# Altium schematic sheet OLD_Trigger_And_Clock_Muxing.SchDoc
size A3; ApprovedBy: Mateusz Kowalik; CheckedBy: Mateusz Kowalik; Author: Mateusz Kowalik; CompanyName: InMotion Labs sp. z o.o.; DrawnBy: Mateusz Kowalik; Engineer: Mateusz Kowalik; Organization: InMotion Labs sp. z o.o.; Address1: Rydlówka 5A; Address2: 30-363 Kraków; Address4: Poland; Revision: Rev 0; SheetNumber: 4; SheetTotal: 16
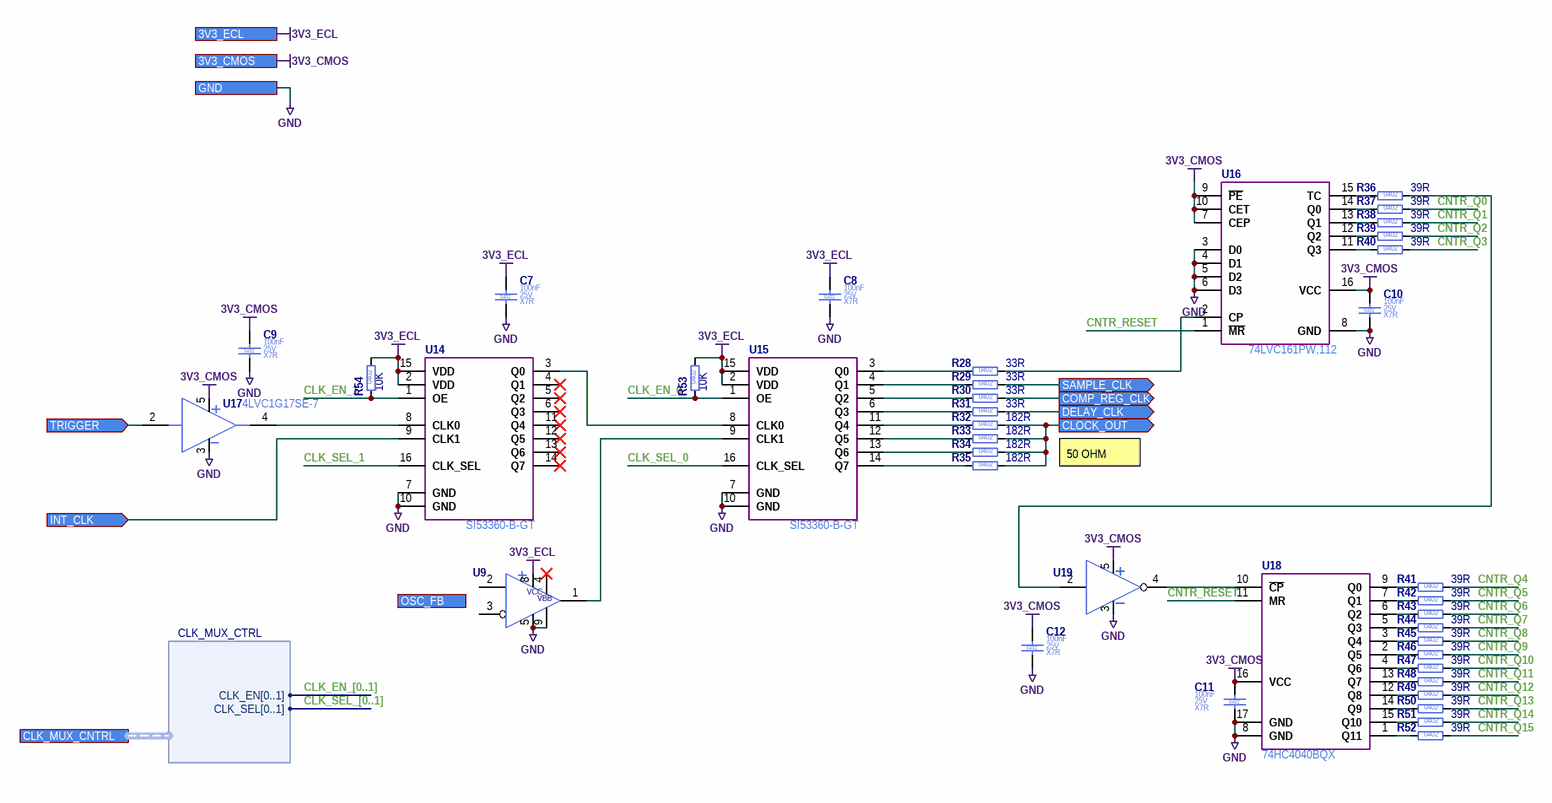
[diagram p0: OLD_Trigger_And_Clock_Muxing.SchDoc]

## Parts
C7  Case/Package: 0402  Voltage Rating (DC): 25V  Dielectric: X7R  Capacitance: 100nF  [C_0402_1005]  (hidden comment: C_100NF_25V_X7R_0402_10)
C8  Case/Package: 0402  Voltage Rating (DC): 25V  Dielectric: X7R  Capacitance: 100nF  [C_0402_1005]  (hidden comment: C_100NF_25V_X7R_0402_10)
C9  Case/Package: 0402  Voltage Rating (DC): 25V  Dielectric: X7R  Capacitance: 100nF  [C_0402_1005]  (hidden comment: C_100NF_25V_X7R_0402_10)
C10  Case/Package: 0402  Voltage Rating (DC): 25V  Dielectric: X7R  Capacitance: 100nF  [C_0402_1005]  (hidden comment: C_100NF_25V_X7R_0402_10)
C11  Case/Package: 0402  Voltage Rating (DC): 25V  Dielectric: X7R  Capacitance: 100nF  [C_0402_1005]  (hidden comment: C_100NF_25V_X7R_0402_10)
C12  Case/Package: 0402  Voltage Rating (DC): 25V  Dielectric: X7R  Capacitance: 100nF  [C_0402_1005]  (hidden comment: C_100NF_25V_X7R_0402_10)
R28  Resistance: 33R  Case/Package: 0402  [R_0402_1005]  (hidden comment: R_33R_0402_1)
R29  Resistance: 33R  Case/Package: 0402  [R_0402_1005]  (hidden comment: R_33R_0402_1)
R30  Resistance: 33R  Case/Package: 0402  [R_0402_1005]  (hidden comment: R_33R_0402_1)
R31  Resistance: 33R  Case/Package: 0402  [R_0402_1005]  (hidden comment: R_33R_0402_1)
R32  Resistance: 182R  Case/Package: 0402  [R_0402_1005]  (hidden comment: R_182R_0402_1)
R33  Resistance: 182R  Case/Package: 0402  [R_0402_1005]  (hidden comment: R_182R_0402_1)
R34  Resistance: 182R  Case/Package: 0402  [R_0402_1005]  (hidden comment: R_182R_0402_1)
R35  Resistance: 182R  Case/Package: 0402  [R_0402_1005]  (hidden comment: R_182R_0402_1)
R36  Resistance: 39R  Case/Package: 0402  [R_0402_1005]  (hidden comment: R_39R_0402_1)
R37  Resistance: 39R  Case/Package: 0402  [R_0402_1005]  (hidden comment: R_39R_0402_1)
R38  Resistance: 39R  Case/Package: 0402  [R_0402_1005]  (hidden comment: R_39R_0402_1)
R39  Resistance: 39R  Case/Package: 0402  [R_0402_1005]  (hidden comment: R_39R_0402_1)
R40  Resistance: 39R  Case/Package: 0402  [R_0402_1005]  (hidden comment: R_39R_0402_1)
R41  Resistance: 39R  Case/Package: 0402  [R_0402_1005]  (hidden comment: R_39R_0402_1)
R42  Resistance: 39R  Case/Package: 0402  [R_0402_1005]  (hidden comment: R_39R_0402_1)
R43  Resistance: 39R  Case/Package: 0402  [R_0402_1005]  (hidden comment: R_39R_0402_1)
R44  Resistance: 39R  Case/Package: 0402  [R_0402_1005]  (hidden comment: R_39R_0402_1)
R45  Resistance: 39R  Case/Package: 0402  [R_0402_1005]  (hidden comment: R_39R_0402_1)
R46  Resistance: 39R  Case/Package: 0402  [R_0402_1005]  (hidden comment: R_39R_0402_1)
R47  Resistance: 39R  Case/Package: 0402  [R_0402_1005]  (hidden comment: R_39R_0402_1)
R48  Resistance: 39R  Case/Package: 0402  [R_0402_1005]  (hidden comment: R_39R_0402_1)
R49  Resistance: 39R  Case/Package: 0402  [R_0402_1005]  (hidden comment: R_39R_0402_1)
R50  Resistance: 39R  Case/Package: 0402  [R_0402_1005]  (hidden comment: R_39R_0402_1)
R51  Resistance: 39R  Case/Package: 0402  [R_0402_1005]  (hidden comment: R_39R_0402_1)
R52  Resistance: 39R  Case/Package: 0402  [R_0402_1005]  (hidden comment: R_39R_0402_1)
R53  Resistance: 10K  Case/Package: 0402  [R_0402_1005]  (hidden comment: R_10K_0402_1)
R54  Resistance: 10K  Case/Package: 0402  [R_0402_1005]  (hidden comment: R_10K_0402_1)
U9  MC100EPT21MNR4G  [SON50P200X80_HS-9N]  (value not drawn)
U14  Si53360-B-GT  [TSOP65P640X120-16N]
U15  Si53360-B-GT  [TSOP65P640X120-16N]
U16  74LVC161PW,112  [TSOP65P640X120-16N]
U17  74LVC1G17SE-7  [SC70-5_SOT353_TSSOP5]
U18  74HC4040BQX  [QFN50P350X250X100_HS-17N]
U19  SN74AHC1G04DBVR  [SOT23-5_SC74A_SOT753_M]  (value not drawn)

## Ports
3V3_CMOS, 3V3_ECL, CLK_MUX_CNTRL (harness CLK_MUX_CTRL), CLOCK_OUT (out), COMP_REG_CLK (out), DELAY_CLK (out), GND, INT_CLK (in), OSC_FB (out), SAMPLE_CLK (out), TRIGGER (in)

## Harnesses
CLK_MUX_CTRL: CLK_SEL[0..1], CLK_EN[0..1]

## Nets
3V3_CMOS: C9.1 C10.1 C11.1 C12.1 U16.7(CEP) U16.9(~{PE}) U16.10(CET) U16.16(VCC) U17.5(VCC) U18.16(VCC) U19.5(VCC) ; port 3V3_CMOS
3V3_ECL: C7.1 C8.1 R53.2 R54.2 U9.8(VDD) U14.2(VDD) U14.15(VDD) U15.2(VDD) U15.15(VDD) ; port 3V3_ECL
GND: C7.2 C8.2 C9.2 C10.2 C11.2 C12.2 U9.5(VSS) U9.9(VSS) U14.7(GND) U14.10(GND) U15.7(GND) U15.10(GND) U16.3(D0) U16.4(D1) U16.5(D2) U16.6(D3) U16.8(GND) U17.3(GND) U18.8(GND) U18.17(GND) U19.3(GND) ; port GND
CLK_EN_0: R53.1 U15.1(OE)
CLK_EN_1: R54.1 U14.1(OE)
CLK_SEL_0: U15.16(CLK_SEL)
CLK_SEL_1: U14.16(CLK_SEL)
CLOCK_OUT: R32.2 R33.2 R34.2 R35.2 ; port CLOCK_OUT
CNTR_Q0: R37.2
CNTR_Q1: R38.2
CNTR_Q2: R39.2
CNTR_Q3: R40.2
CNTR_Q4: R41.2
CNTR_Q5: R42.2
CNTR_Q6: R43.2
CNTR_Q7: R44.2
CNTR_Q8: R45.2
CNTR_Q9: R46.2
CNTR_Q10: R47.2
CNTR_Q11: R48.2
CNTR_Q12: R49.2
CNTR_Q13: R50.2
CNTR_Q14: R51.2
CNTR_Q15: R52.2
CNTR_RESET: U16.1(~{MR}) U18.11(MR)
COMP_REG_CLK: R30.2 ; port COMP_REG_CLK
DELAY_CLK: R31.2 ; port DELAY_CLK
INT_CLK: U14.9(CLK1) ; port INT_CLK
SAMPLE_CLK: R29.2 ; port SAMPLE_CLK
TRIGGER: U17.2(A) ; port TRIGGER
NetR28_1: R28.1 U15.3(Q0)
NetR28_2: R28.2 U16.2(CP)
NetR29_1: R29.1 U15.4(Q1)
NetR30_1: R30.1 U15.5(Q2)
NetR31_1: R31.1 U15.6(Q3)
NetR32_1: R32.1 U15.11(Q4)
NetR33_1: R33.1 U15.12(Q5)
NetR34_1: R34.1 U15.13(Q6)
NetR35_1: R35.1 U15.14(Q7)
NetR36_1: R36.1 U16.15(TC)
NetR36_2: R36.2 U19.2
NetR37_1: R37.1 U16.14(Q0)
NetR38_1: R38.1 U16.13(Q1)
NetR39_1: R39.1 U16.12(Q2)
NetR40_1: R40.1 U16.11(Q3)
NetR41_1: R41.1 U18.9(Q0)
NetR42_1: R42.1 U18.7(Q1)
NetR43_1: R43.1 U18.6(Q2)
NetR44_1: R44.1 U18.5(Q3)
NetR45_1: R45.1 U18.3(Q4)
NetR46_1: R46.1 U18.2(Q5)
NetR47_1: R47.1 U18.4(Q6)
NetR48_1: R48.1 U18.13(Q7)
NetR49_1: R49.1 U18.12(Q8)
NetR50_1: R50.1 U18.14(Q9)
NetR51_1: R51.1 U18.15(Q10)
NetR52_1: R52.1 U18.1(Q11)
NetU9_1: U9.1(OUTA) U15.9(CLK1)
NetU14_3: U14.3(Q0) U15.8(CLK0)
NetU14_8: U14.8(CLK0) U17.4(Y)
NetU18_10: U18.10(~{CP}) U19.4(OutY)

Not connected (* = marked no-connect by the designer): U9 2(D) 3(~{D}) 4(VDD)*; U14 4(Q1)* 5(Q2)* 6(Q3)* 11(Q4)* 12(Q5)* 13(Q6)* 14(Q7)*; U19 1(NC)

## Buses and harness runs
bus CLK_EN_[0..1]
bus CLK_SEL_[0..1]

## Notes on the sheet
- 50 OHM
- Title
- Size:
- Date:
- A3
- (in symbol MC100EPT21MNR4G) VCC; VBB

## Library data of the parts
C7-C12 = C_100NF_25V_X7R_0402_10: Ceramic Capacitor; Manufacturer Part Number: EMK105B7104KV-F; Manufacturer: Taiyo Yuden; Value: 100nF; Tolerance: 10%; Part Number: C_100NF_25V_X7R_0402_10; Mount: Surface Mount; Height: 500um; HelpURL: https://pl.mouser.com/datasheet/2/396/mlcc02_e-1307760.pdf; RoHS: Compliant; Max Operating Temperature: 125°C; Status: AK; Supplier 1: Mouser; Supplier Part Number 1: 963-EMK105B7104KV-F
R28-R31 = R_33R_0402_1: Thick Film Resistor; Manufacturer: Yageo; Manufacturer Part Number: RC0402FR-0733RL; Value: 33R; Tolerance: 1%; Voltage Rating (DC): 50V; Power Rating: 63mW; Stats: MK; Part Number: R_33R_0402_1; Mount: Surface Mount; Height: 350um; HelpURL: https://pl.mouser.com/datasheet/2/447/PYu-RC_Group_51_RoHS_L_10-1527934.pdf; RoHS: Compliant; Max Operating Temperature: 155°C; Supplier 1: Mouser; Supplier Part Number 1: 603-RC0402FR-0733RL
R32-R35 = R_182R_0402_1: Thick Film Resistor; Manufacturer: Yageo; Manufacturer Part Number: RC0402FR-07182RL; Value: 182R; Tolerance: 1%; Voltage Rating (DC): 50V; Power Rating: 63mW; Stats: MK; Part Number: R_182R_0402_1; Mount: Surface Mount; Height: 350um; HelpURL: http://datasheet.octopart.com/RC0402FR-07100KL-Yageo-datasheet-127823281.pdf; RoHS: Compliant; Max Operating Temperature: 155°C; Supplier 1: Mouser; Supplier Part Number 1: 603-RC0402FR-07182RL
R36-R52 = R_39R_0402_1: Thick Film Resistor; Manufacturer: Yageo; Manufacturer Part Number: RC0402FR-0739RL; Value: 39R; Tolerance: 1%; Voltage Rating (DC): 50V; Power Rating: 63mW; Stats: MK; Part Number: R_39R_0402_1; Mount: Surface Mount; Height: 350um; HelpURL: https://pl.mouser.com/datasheet/2/447/PYu-RC_Group_51_RoHS_L_10-1664068.pdf; RoHS: Compliant; Max Operating Temperature: 155°C; Supplier 1: Mouser; Supplier Part Number 1: 603-RC0402FR-0739RL
R53 R54 = R_10K_0402_1: Thick Film Resistor; Manufacturer: Yageo; Manufacturer Part Number: RC0402FR-7W10KL; Value: 10K; Tolerance: 1%; Voltage Rating (DC): 50V; Power Rating: 63mW; Stats: MK; Part Number: R_10K_0402_1; Mount: Surface Mount; Height: 350um; HelpURL: https://pl.mouser.com/datasheet/2/447/PYu-RC_Group_51_RoHS_L_10-1664068.pdf; RoHS: Compliant; Max Operating Temperature: 155°C; Supplier 1: Mouser; Supplier Part Number 1: 603-RC0402FR-7W10KL
U9 = MC100EPT21MNR4G: Differential LVPECL/LVDS/CML to LVTTL/LVCMOS Translator; Manufacturer: ON Semiconductor; Output Current: 24mA; Marking: 3RM; Max Supply Voltage: 3.8V; Min Supply Voltage: 3.3V; Part Number: MC100EPT21MNR4G; Case/Package: DFN-8; Max Output Current: 24mA; Mount: Surface Mount; Height: 1mm; HelpURL: https://datasheet.octopart.com/MC100EPT21MNR4G-ON-Semiconductor-datasheet-12520234.pdf; Max Operating Temperature: 85°C; RoHS: Compliant; Status: MK; Manufacturer Part Number: MC100EPT21MNR4G; Supplier 1: Mouser; Supplier Part Number 1: 863-MC100EPT21MNR4G
U14 U15 = Si53360-B-GT: Low Jitter Clock Buffer; Manufacturer: Silicon Labs; Max Frequency: 200MHz; Max Supply Voltage: 3.6V; Min Supply Voltage: 2.25V; Part Number: Si53360-B-GT; Case/Package: TSSOP16; Mount: Surface Mount; Height: 1.2mm; HelpURL: https://pl.mouser.com/datasheet/2/368/Si5336x-datasheet-1397964.pdf; Logic Function: Clock Buffer; Marking: Si53360; Max Operating Temperature: 85°C; RoHS: Compliant; Status: MK; Manufacturer Part Number: SI53360-B-GT; Supplier 1: Mouser; Supplier Part Number 1: 634-SI53360-B-GT
U16 = 74LVC161PW,112: 4 bit Counter with preset; Manufacturer: Nexperia; Output Current: 50mA; Max Supply Voltage: 3.6V; Min Supply Voltage: 1.65V; Part Number: 74LVC161PW,112; Case/Package: TSSOP16; Max Output Current: 50mA; Mount: Surface Mount; Height: 1.1mm; HelpURL: https://pl.mouser.com/datasheet/2/916/74LVC161-1319465.pdf; Max Operating Temperature: 125°C; RoHS: Compliant; Status: MK; Manufacturer Part Number: 74LVC161PW,112; Supplier 1: Mouser; Supplier Part Number 1: 771-LVC161PW112
U17 = 74LVC1G17SE-7: Schmitt Buffer; Manufacturer: Diodes Incorporated; Output Current: 24mA; Marking: UR; Max Supply Voltage: 5.5V; Min Supply Voltage: 1.65V; Manufacturer Part Number: 74LVC1G17SE-7; Part Number: 74LVC1G17SE-7; Case/Package: SOT-353; Max Output Current: 24mA; Mount: Surface Mount; HelpURL: https://datasheet.octopart.com/74LVC1G17SE-7-Diodes-Inc.-datasheet-46750521.pdf; Max Operating Temperature: 125°C; RoHS: Compliant; Status: MK; Supplier 1: Mouser; Supplier Part Number 1: 621-74LVC1G17SE-7
U18 = 74HC4040BQX: 12 bit binary ripple counter; Manufacturer: Nexperia; Output Current: 25mA; Max Supply Voltage: 5.5V; Min Supply Voltage: 2.7V; Manufacturer Part Number: 74HC4040BQX; Part Number: 74HC4040BQX; Case/Package: DHVQFN16; Max Output Current: 25mA; Mount: Surface Mount; Height: 1mm; HelpURL: https://pl.mouser.com/datasheet/2/916/74HC_HCT4040-1319793.pdf; Max Operating Temperature: 125°C; RoHS: Compliant; Status: MK; Supplier 1: Mouser; Supplier Part Number 1: 771-74HC4040BQX
U19 = SN74AHC1G04DBVR: Inverters Single; Manufacturer: Texas Instruments; Output Current: 25mA; Max Output Current: 50mA; Max Supply Voltage: 5.5V; Min Supply Voltage: 2V; Part Number: SN74AHC1G04DBVR; Case/Package: SOT-23; Mount: Surface Mount; Height: 1.1mm; HelpURL: http://www.ti.com/lit/ds/symlink/sn74ahc1g04.pdf; Max Operating Temperature: 125°C; RoHS: Compliant; Status: AK; Manufacturer Part Number: SN74AHC1G04DBVR